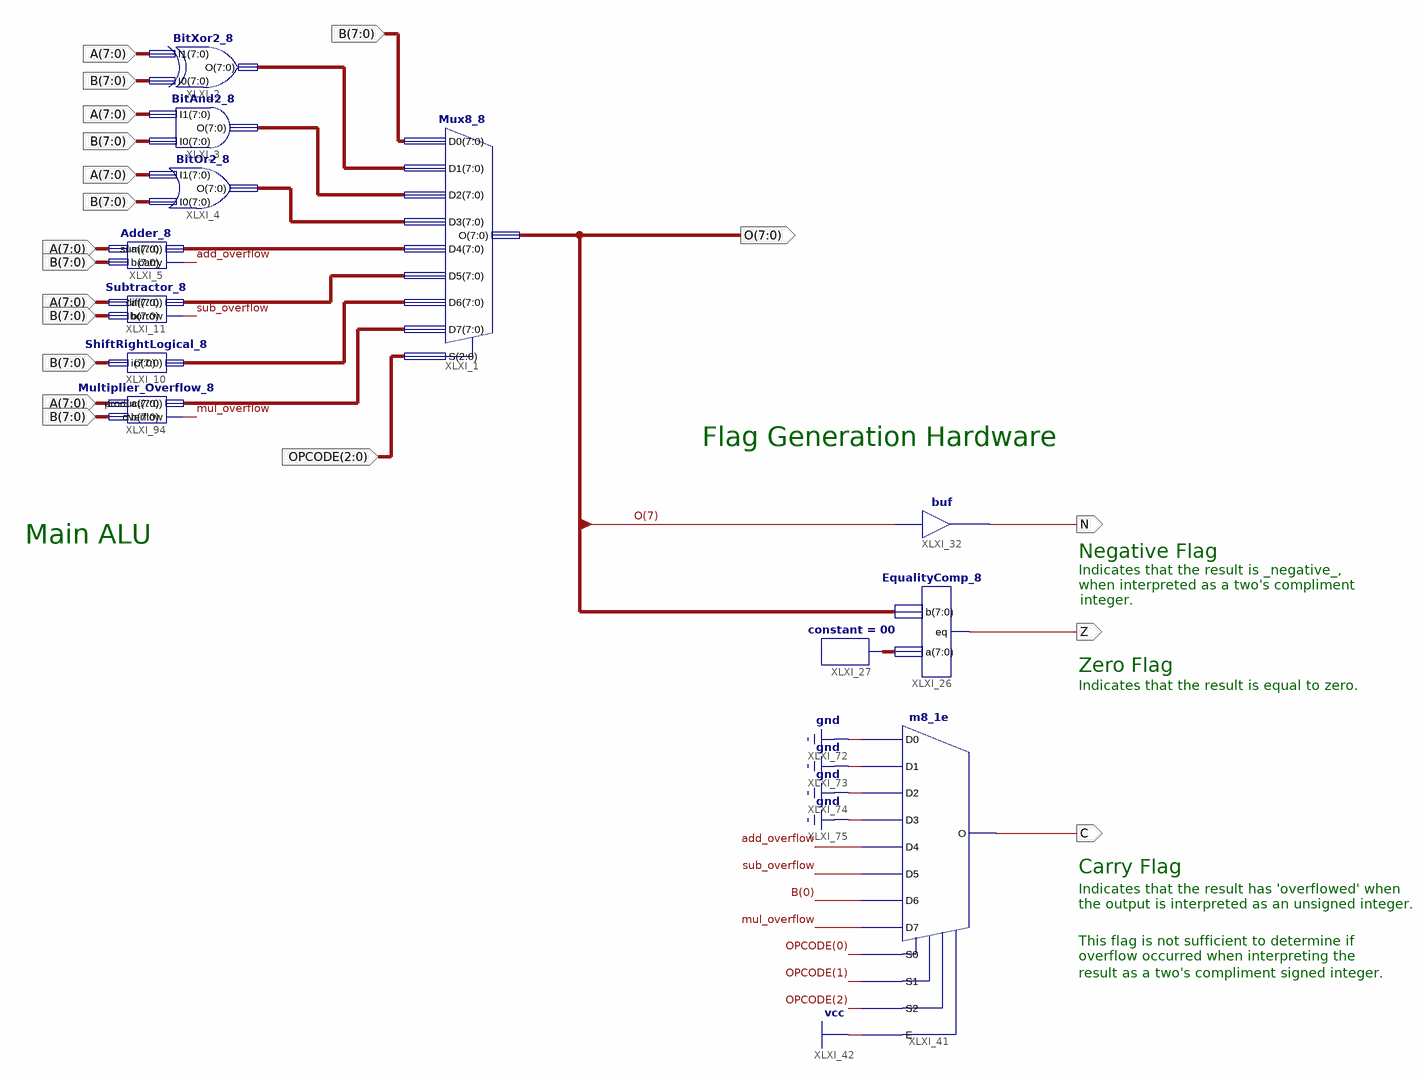
[diagram p0: schematic sheet 1]
// Xilinx ISE schematic ALU.sch (spartan3e) as structural Verilog: 12 symbols, 7 ports
module ALU (
  input  [7:0] B,
  input  [2:0] OPCODE,
  input  [7:0] A,
  output [7:0] O,
  output C,
  output Z,
  output N
);

  wire add_overflow, mul_overflow, sub_overflow;
  wire [7:0] XLXN_3, XLXN_4, XLXN_5, XLXN_6, XLXN_8, XLXN_9, XLXN_24, XLXN_55;

  Mux8_8 XLXI_1 (
    .D0(B), .D1(XLXN_3), .D2(XLXN_4), .D3(XLXN_5), .D4(XLXN_6), .D5(XLXN_24), .D6(XLXN_8), .D7(XLXN_9),
    .S(OPCODE), .O(O));
  BitXor2_8 XLXI_2 (.I0(B), .I1(A), .O(XLXN_3));
  BitAnd2_8 XLXI_3 (.I0(B), .I1(A), .O(XLXN_4));
  BitOr2_8 XLXI_4 (.I0(B), .I1(A), .O(XLXN_5));
  Adder_8 XLXI_5 (.a(A), .b(B), .sum(XLXN_6), .carry(add_overflow));
  Subtractor_8 XLXI_11 (.a(A), .b(B), .borrow(sub_overflow), .diff(XLXN_24));
  ShiftRightLogical_8 XLXI_10 (.o(XLXN_8), .i(B));
  EqualityComp_8 XLXI_26 (.a(XLXN_55), .b(O), .eq(Z));
  constant #(.CValue("00")) XLXI_27 (.O(XLXN_55));
  m8_1e XLXI_41 (
    .D0(1'b0), .D1(1'b0), .D2(1'b0), .D3(1'b0), .D4(add_overflow), .D5(sub_overflow), .D6(B[0]),
    .D7(mul_overflow), .E(1'b1), .S0(OPCODE[0]), .S1(OPCODE[1]), .S2(OPCODE[2]), .O(C));
  buf XLXI_32 (N, O[7]);
  Multiplier_Overflow_8 XLXI_94 (.a(A), .b(B), .product(XLXN_9), .overflow(mul_overflow));

  // Notes on the sheet:
  //   Flag Generation Hardware
  //   Main ALU
  //   Negative Flag
  //   Indicates that the result is _negative_,
  //   when interpreted as a two's compliment
  //   integer.
  //   Zero Flag
  //   Indicates that the result is equal to zero.
  //   Carry Flag
  //   Indicates that the result has 'overflowed' when
  //   the output is interpreted as an unsigned integer.
  //   This flag is not sufficient to determine if
  //   overflow occurred when interpreting the
  //   result as a two's compliment signed integer.
endmodule
